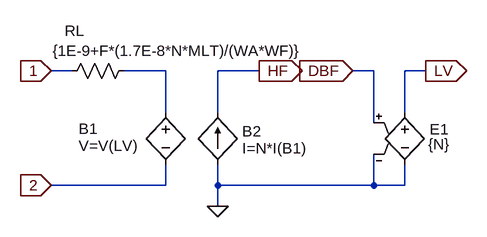
[diagram p0: schematic winding.asc]
winding.asc, the LTspice schematic file:
Version 4
SHEET 1 880 680
WIRE -288 144 -320 144
WIRE -144 144 -208 144
WIRE 0 144 -64 144
WIRE 176 144 144 144
WIRE 256 144 224 144
WIRE -144 208 -144 144
WIRE -64 208 -64 144
WIRE 224 208 224 144
WIRE 176 224 176 144
WIRE -144 320 -144 288
WIRE -144 320 -320 320
WIRE -64 320 -64 288
WIRE 176 320 176 272
WIRE 176 320 -64 320
WIRE 224 320 224 288
WIRE 224 320 176 320
WIRE -64 352 -64 320
FLAG 0 144 HF
IOPIN 0 144 Out
FLAG 256 144 LV
IOPIN 256 144 Out
FLAG 144 144 DBF
IOPIN 144 144 In
FLAG -320 144 1
IOPIN -320 144 In
FLAG -320 320 2
IOPIN -320 320 In
FLAG -64 352 0
SYMBOL res -192 128 R90
WINDOW 0 -30 92 VBottom 0
WINDOW 3 -31 -67 VTop 0
SYMATTR InstName RL
SYMATTR Value {1E-9+F*(1.7E-8*N*MLT)/(WA*WF)}
SYMBOL e 224 192 R0
WINDOW 0 38 42 Left 0
WINDOW 3 36 65 Left 0
SYMATTR InstName E1
SYMATTR Value {N}
SYMBOL bv -144 192 R0
WINDOW 0 -134 41 Left 0
WINDOW 3 -134 67 Left 0
SYMATTR InstName B1
SYMATTR Value V=V(LV)
SYMBOL bi2 -64 208 R0
WINDOW 0 38 29 Left 0
WINDOW 3 38 55 Left 0
SYMATTR InstName B2
SYMATTR Value I=N*I(B1)

The netlist it stands for:
* winding.asc
RL N001 1 {1E-9+F*(1.7E-8*N*MLT)/(WA*WF)}
E1 LV 0 DBF 0 {N}
B1 N001 2 V=V(LV)
B2 0 HF I=N*I(B1)
.backanno
.end